# Altium schematic sheet 07_DC Jack and DCDC.SchDoc: C200
size 594 x 420 mm; Page Create Date: March  8, 1995; Page Number: 7; Page Size: A2; Comment: radxa_1010; Page Count: 21; RevCode: V1.11; Doc: 07_DC Jack and DCDC; DsnPath: D:\WMS\C200\CC122\对外\C200 V1.11.DSN; SchematicName: c200; PageName: 07_DC Jack and DCDC; PageSize: A2; TopSchematic: True
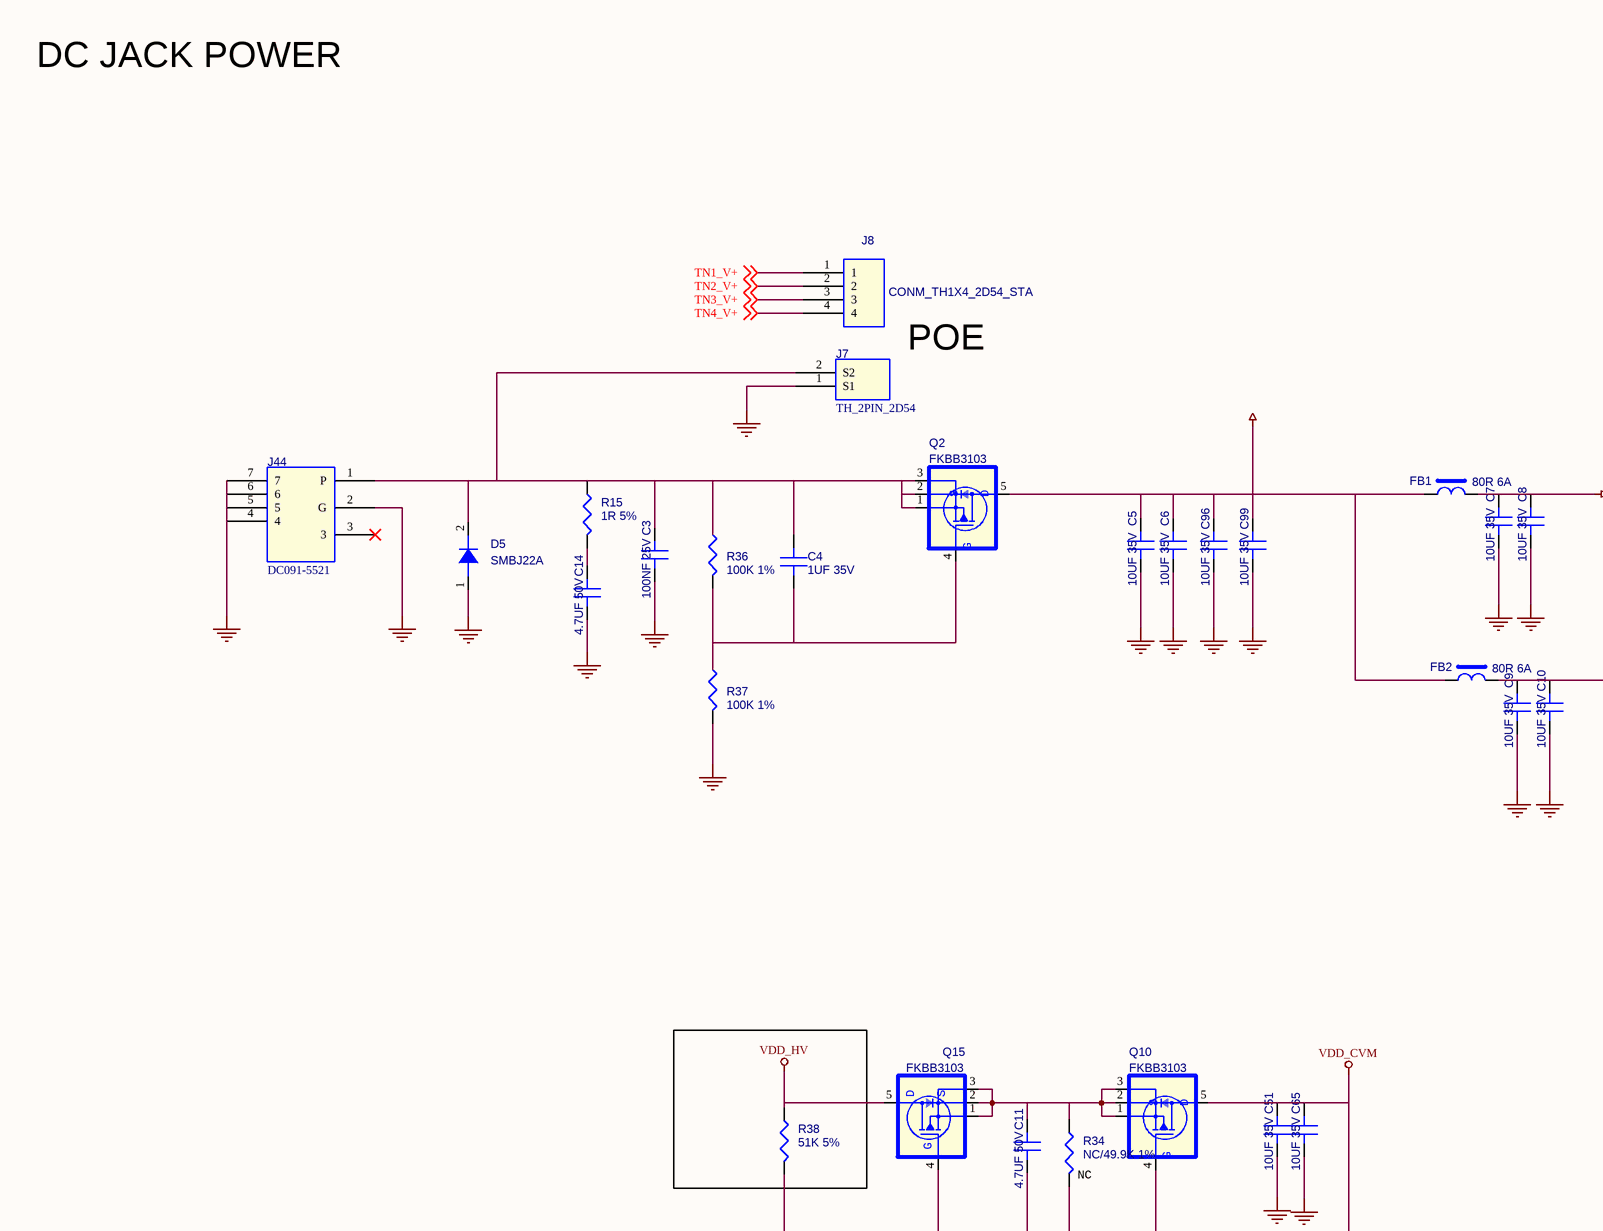
[diagram p0: 07_DC Jack and DCDC.SchDoc, top left]
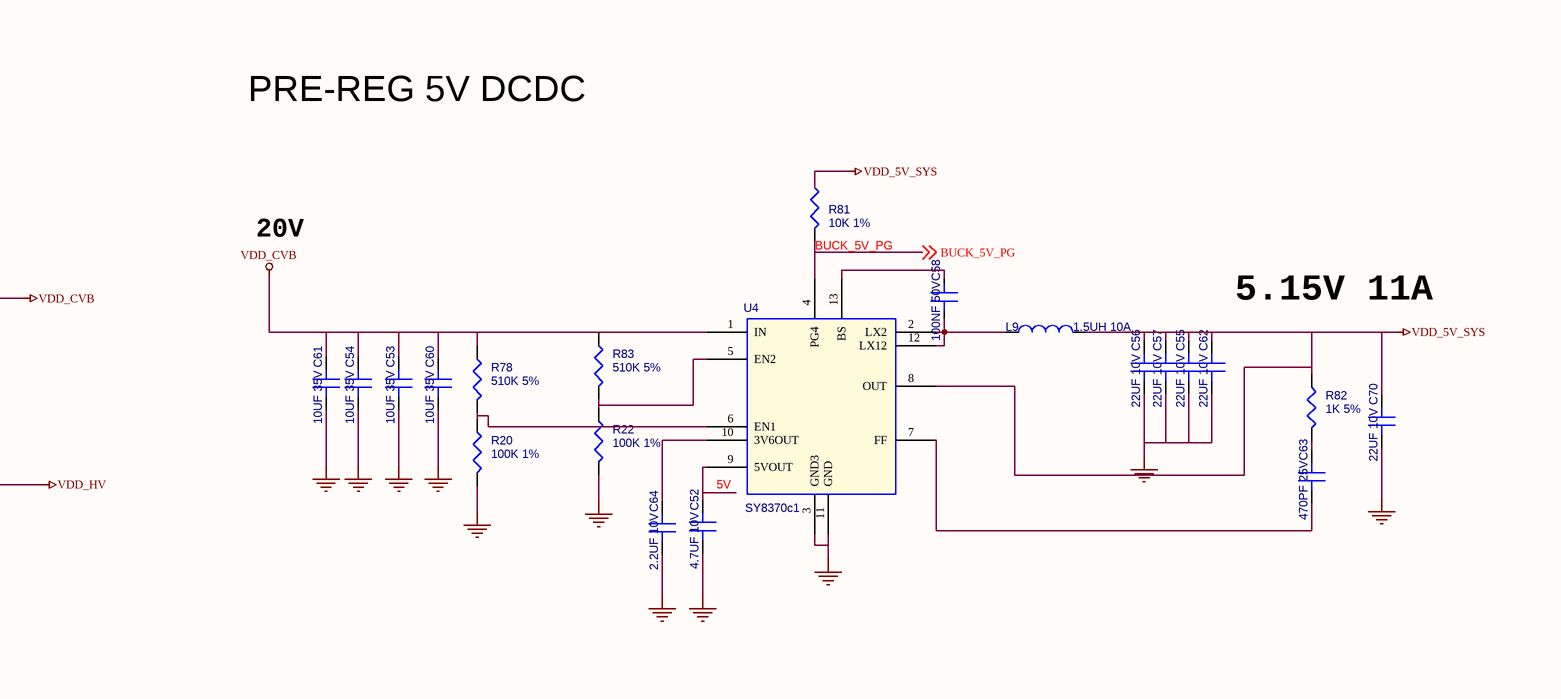
[diagram p1: 07_DC Jack and DCDC.SchDoc, top right]
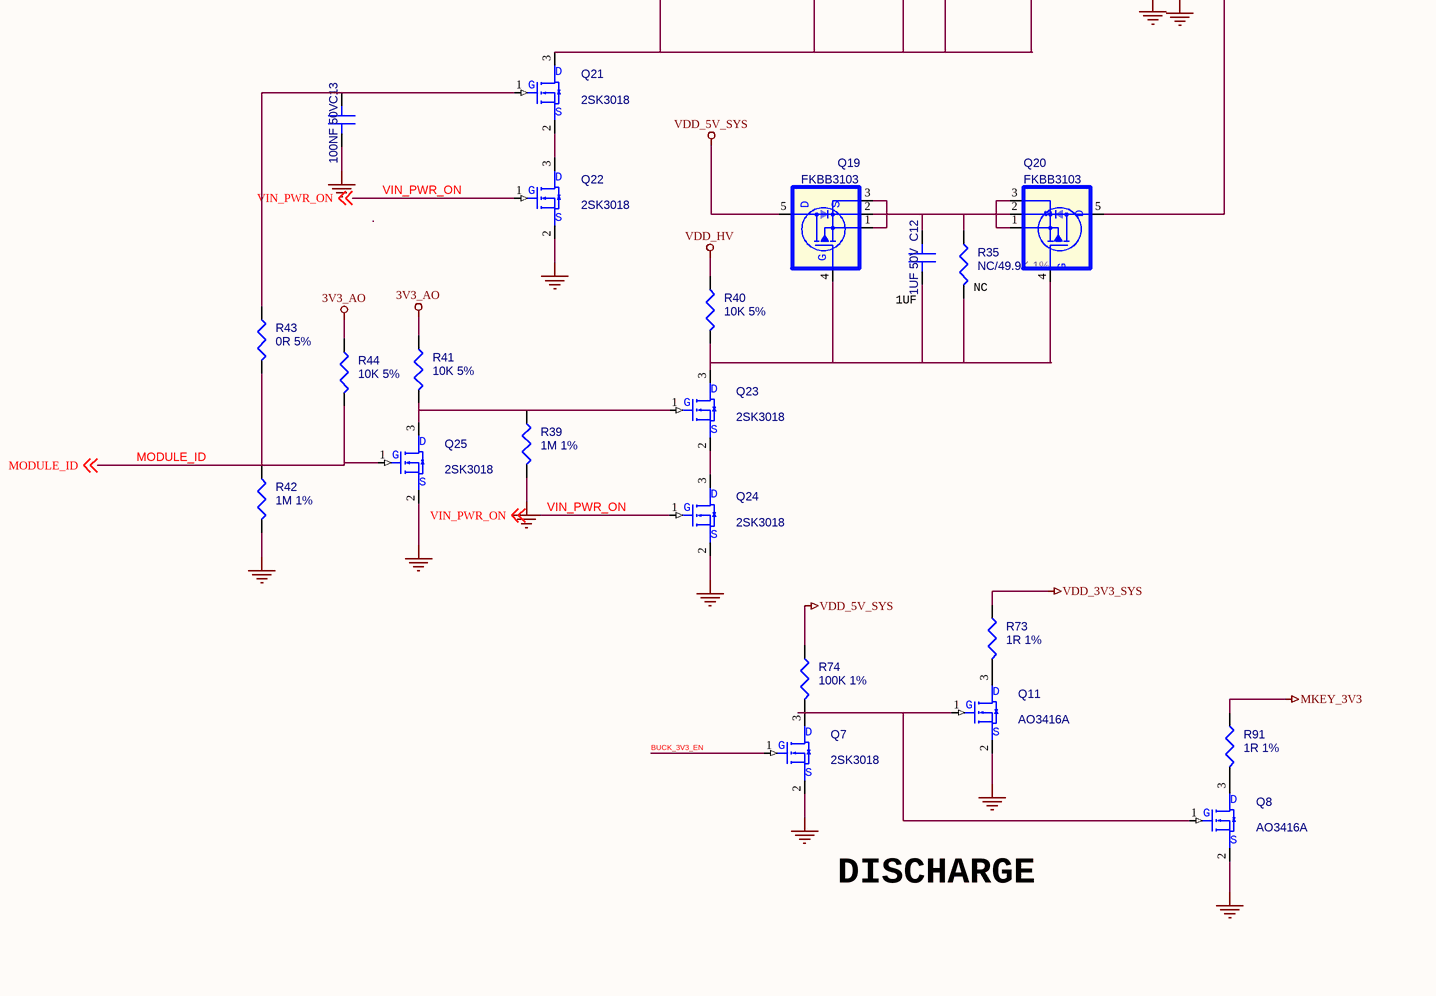
[diagram p2: 07_DC Jack and DCDC.SchDoc, bottom left]
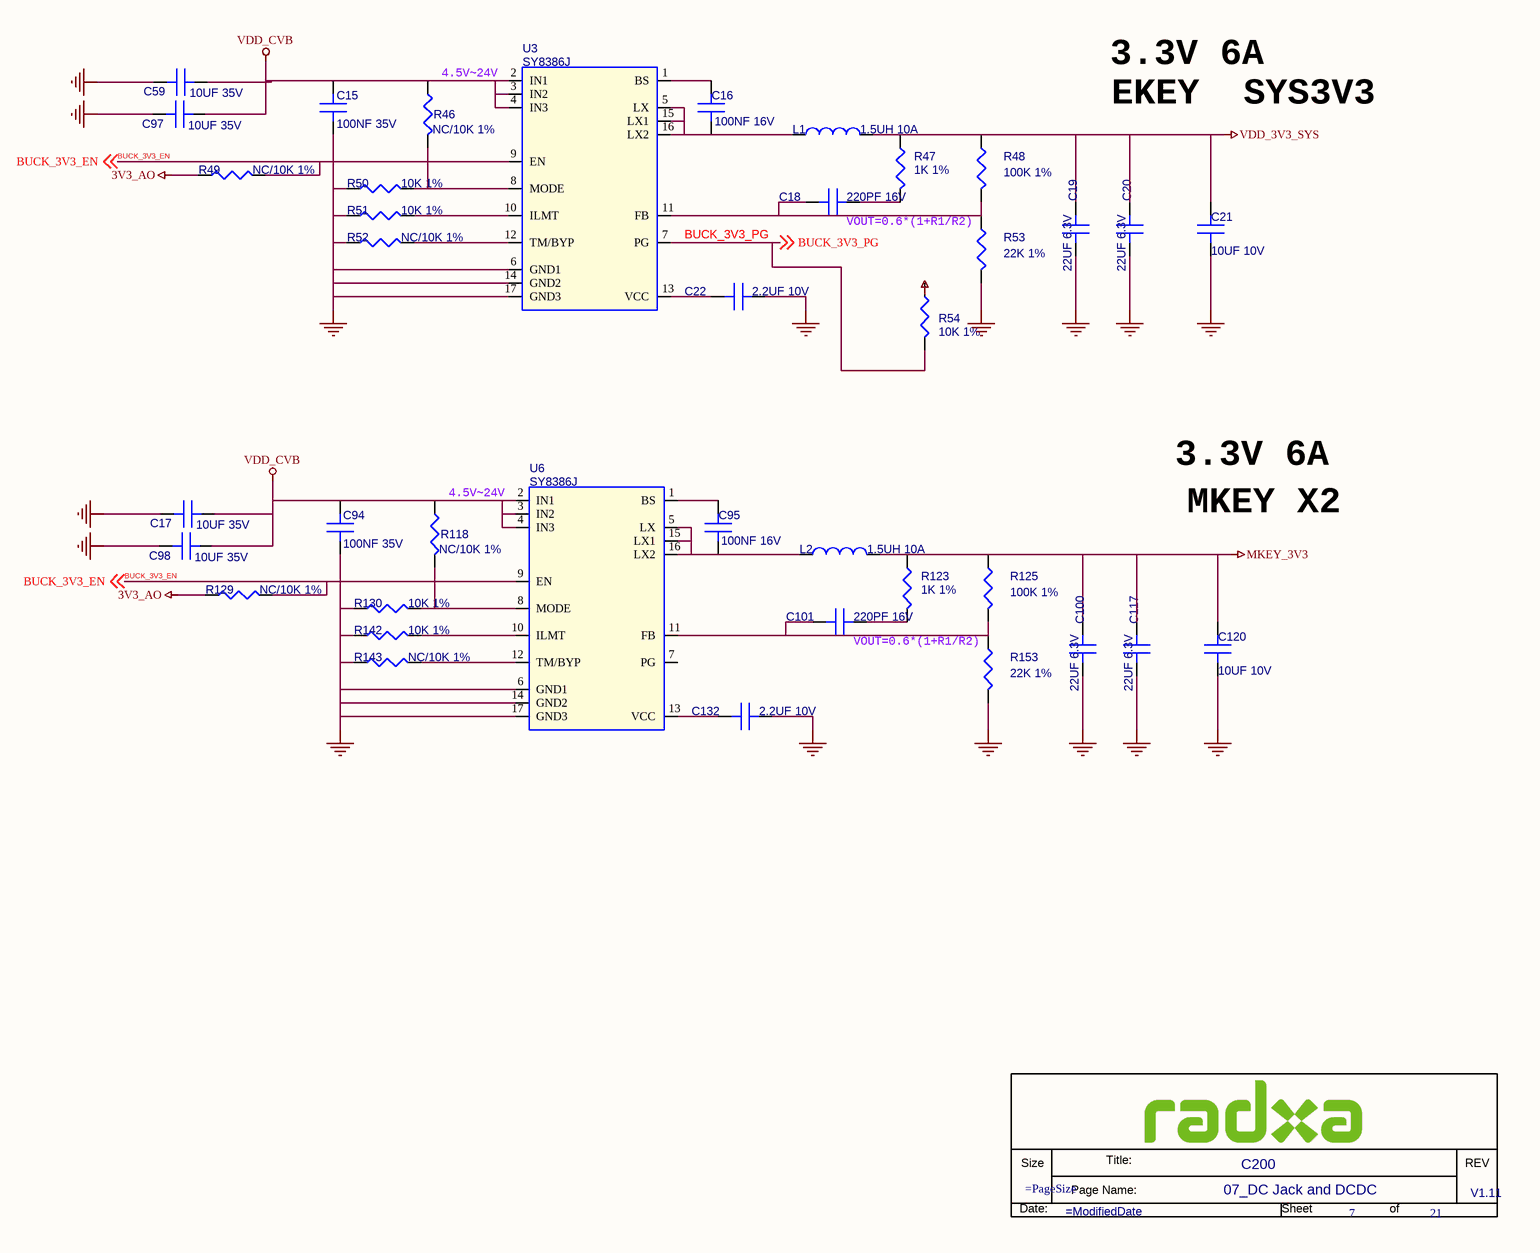
[diagram p3: 07_DC Jack and DCDC.SchDoc, bottom right]

## Parts
*  Doc: 07_DC Jack and DCDC  RevCode: V1.11  Title: C200  Page Number: 7  Page Count: 21  (hidden comment: radxa_1010)  (graphical)
C3  100NF 25V  [C0402]
C4  1UF 35V  [C0402]
C5  10UF 35V  [C1206]
C6  10UF 35V  [C1206]
C7  10UF 35V  [C1206]
C8  10UF 35V  [C1206]
C9  10UF 35V  [C1206]
C10  10UF 35V  [C1206]
C11  4.7UF 50V  [C0805]
C12  1UF 50V  [C0805]
C13  100NF 50V  [C0201]
C14  4.7UF 50V  [C0805]
C15  100NF 35V  [C0201]
C16  100NF 16V  [C0402]
C17  10UF 35V  [C1206]
C18  220PF 16V  [C0402]
C19  22UF 6.3V  [C0603]
C20  22UF 6.3V  [C0603]
C21  10UF 10V  [C0603]
C22  2.2UF 10V  [C0402]
C51  10UF 35V  [C1206]
C52  4.7UF 10V  [C0402]
C53  10UF 35V  [C1206]
C54  10UF 35V  [C1206]
C55  22UF 10V  [C0603]
C56  22UF 10V  [C0603]
C57  22UF 10V  [C0603]
C58  100NF 50V  [C0201]
C59  10UF 35V  [C1206]
C60  10UF 35V  [C1206]
C61  10UF 35V  [C1206]
C62  22UF 10V  [C0603]
C63  470PF 25V  [C0201]
C64  2.2UF 10V  [C0402]
C65  10UF 35V  [C1206]
C70  22UF 10V  [C0603]
C94  100NF 35V  [C0201]
C95  100NF 16V  [C0402]
C96  10UF 35V  [C1206]
C97  10UF 35V  [C1206]
C98  10UF 35V  [C1206]
C99  10UF 35V  [C1206]
C100  22UF 6.3V  [C0603]
C101  220PF 16V  [C0402]
C117  22UF 6.3V  [C0603]
C120  10UF 10V  [C0603]
C132  2.2UF 10V  [C0402]
D5  SMBJ22A  [DO_214AA]
FB1  80R 6A  [FB0805]
FB2  80R 6A  [FB0805]
J7  TH_2PIN_2D54  [CON_TH1X2_2D54_STA]
J8  CONM_TH1X4_2D54_STA  [CONM_TH1X4_2D54_STA]
J44  DC091-5521  [DC_TH7_13D5x11D45]
L1  1.5UH 10A  [L_5030]
L2  1.5UH 10A  [L_5030]
L9  1.5UH 10A  [L_5030]
Q2  FKBB3103  [DFN3X3_EP]
Q7  2SK3018  [SOT_323]
Q8  AO3416A  [SOT_23]
Q10  FKBB3103  [DFN3X3_EP]
Q11  AO3416A  [SOT_23]
Q15  FKBB3103  [DFN3X3_EP]
Q19  FKBB3103  [DFN3X3_EP]
Q20  FKBB3103  [DFN3X3_EP]
Q21  2SK3018  [SOT_323]
Q22  2SK3018  [SOT_323]
Q23  2SK3018  [SOT_323]
Q24  2SK3018  [SOT_323]
Q25  2SK3018  [SOT_323]
R15  1R 5%  [R0402]
R20  100K 1%  [R0402]
R22  100K 1%  [R0402]
R34  NC/49.9K 1%  [R0402]
R35  NC/49.9K 1%  [R0402]
R36  100K 1%  [R0402]
R37  100K 1%  [R0402]
R38  51K 5%  [R0402]
R39  1M 1%  [R0402]
R40  10K 5%  [R0402]
R41  10K 5%  [R0402]
R42  1M 1%  [R0402]
R43  0R 5%  [R0402]
R44  10K 5%  [R0402]
R46  NC/10K 1%  [R0402]
R47  1K 1%  [R0402]
R48  100K 1%  [R0402]
R49  NC/10K 1%  [R0402]
R50  10K 1%  [R0402]
R51  10K 1%  [R0402]
R52  NC/10K 1%  [R0402]
R53  22K 1%  [R0402]
R54  10K 1%  [R0402]
R73  1R 1%  [R0402]
R74  100K 1%  [R0402]
R78  510K 5%  [R0402]
R81  10K 1%  [R0402]
R82  1K 5%  [R0402]
R83  510K 5%  [R0402]
R91  1R 1%  [R0402]
R118  NC/10K 1%  [R0402]
R123  1K 1%  [R0402]
R125  100K 1%  [R0402]
R129  NC/10K 1%  [R0402]
R130  10K 1%  [R0402]
R142  10K 1%  [R0402]
R143  NC/10K 1%  [R0402]
R153  22K 1%  [R0402]
U3  SY8386J  [qfn-16-2525]
U4  SY8370c1  [SY8370]
U6  SY8386J  [qfn-16-2525]

## Nets
3V3_AO: R41.1 R44.1 R49.1 R129.1
GND: C3.2(B) C5.2(B) C6.2(B) C7.2(B) C8.2(B) C9.2(B) C10.2(B) C13.2(B) C14.2(B) C15.1(A) C17.2(B) C19.2(B) C20.2(B) C21.2(B) C22.2(B) C51.2(B) C52.2(B) C53.2(B) C54.2(B) C55.2(B) C56.2(B) C57.2(B) C59.2(B) C60.2(B) C61.2(B) C62.2(B) C64.2(B) C65.2(B) C70.2(B) C94.1(A) C96.2(B) C97.2(B) C98.2(B) C99.2(B) C100.2(B) C117.2(B) C120.2(B) C132.2(B) D5.1(A) J7.1(S1) J44.2(G) J44.4 J44.5 J44.6 J44.7 Q7.2(S) Q8.2(S) Q11.2(S) Q22.2(S) Q24.2(S) Q25.2(S) R20.2 R22.2 R37.2 R39.2 R42.2 R50.1 R51.1 R52.1 R53.2 R130.1 R142.1 R143.1 R153.2 U3.6(GND1) U3.14(GND2) U3.17(GND3) U4.3(GND3) U4.11(GND) U6.6(GND1) U6.14(GND2) U6.17(GND3)
MKEY_3V3: C100.1(A) C117.1(A) C120.1(A) L2.2 R91.1 R123.1 R125.1
VDD_3V3_SYS: C19.1(A) C20.1(A) C21.1(A) L1.2 R47.1 R48.1 R73.1
VDD_5V_SYS: C55.1(A) C56.1(A) C57.1(A) C62.1(A) C70.1(A) L9.2 Q19.5(D) R74.1 R81.1 R82.1 U4.8(OUT)
VDD_CVB: C7.1(A) C8.1(A) C15.2(B) C17.1(A) C53.1(A) C54.1(A) C59.1(A) C60.1(A) C61.1(A) C94.2(B) C97.1(A) C98.1(A) FB1.2 R46.1 R78.1 R83.1 R118.1 U3.2(IN1) U3.3(IN2) U3.4(IN3) U4.1(IN) U6.2(IN1) U6.3(IN2) U6.4(IN3)
VDD_CVM: C51.1(A) C65.1(A) Q10.5(D) Q20.5(D)
VDD_DCIN: C5.1(A) C6.1(A) C96.1(A) C99.1(A) FB1.1 FB2.1 Q2.5(D)
VDD_HV: C9.1(A) C10.1(A) FB2.2 Q15.5(D) R38.1 R40.1
5V: C52.1(A) U4.9(5VOUT)
BUCK_3V3_EN: Q7.1(G) R49.2 R129.2 U3.9(EN) U6.9(EN) ; off-sheet BUCK_3V3_EN
BUCK_3V3_PG: R54.2 U3.7(PG) ; off-sheet BUCK_3V3_PG
BUCK_5V_PG: R81.2 U4.4(PG4) ; off-sheet BUCK_5V_PG
MODULE_ID: Q25.1(G) R42.1 R43.2 R44.2 ; off-sheet MODULE_ID
TN1_V+: J8.1 ; off-sheet TN1_V+
TN2_V+: J8.2 ; off-sheet TN2_V+
TN3_V+: J8.3 ; off-sheet TN3_V+
TN4_V+: J8.4 ; off-sheet TN4_V+
VIN_PWR_ON: Q22.1(G) Q24.1(G) ; off-sheet VIN_PWR_ON
NetC3_1: C3.1(A) C4.1(A) D5.2(K) J7.2(S2) J44.1(P) Q2.1(S1) Q2.2(S2) Q2.3(S3) R15.1 R36.1
NetC4_2: C4.2(B) Q2.4(G) R36.2 R37.1
NetC11_1: C11.1(A) Q10.1(S1) Q10.2(S2) Q10.3(S3) Q15.1(S1) Q15.2(S2) Q15.3(S3) R34.1
NetC11_2: C11.2(B) Q10.4(G) Q15.4(G) Q21.3(D) R34.2 R38.2
NetC12_1: C12.1(A) Q19.1(S1) Q19.2(S2) Q19.3(S3) Q20.1(S1) Q20.2(S2) Q20.3(S3) R35.1
NetC12_2: C12.2(B) Q19.4(G) Q20.4(G) Q23.3(D) R35.2 R40.2
NetC13_1: C13.1(A) Q21.1(G) R43.1
NetC14_1: C14.1(A) R15.2
NetC16_1: C16.1(A) L1.1 U3.5(LX) U3.15(LX1) U3.16(LX2)
NetC16_2: C16.2(B) U3.1(BS)
NetC18_1: C18.1(A) R48.2 R53.1 U3.11(FB)
NetC18_2: C18.2(B) R47.2
NetC22_1: C22.1(A) U3.13(VCC)
NetC58_1: C58.1(A) U4.13(BS)
NetC58_2: C58.2(B) L9.1 U4.2(LX2) U4.12(LX12)
NetC63_1: C63.1(A) R82.2
NetC63_2: C63.2(B) U4.7(FF)
NetC64_1: C64.1(A) U4.10(3V6OUT)
NetC95_1: C95.1(A) L2.1 U6.5(LX) U6.15(LX1) U6.16(LX2)
NetC95_2: C95.2(B) U6.1(BS)
NetC101_1: C101.1(A) R125.2 R153.1 U6.11(FB)
NetC101_2: C101.2(B) R123.2
NetC132_1: C132.1(A) U6.13(VCC)
NetQ7_3: Q7.3(D) Q8.1(G) Q11.1(G) R74.2
NetQ8_3: Q8.3(D) R91.2
NetQ11_3: Q11.3(D) R73.2
NetQ21_2: Q21.2(S) Q22.3(D)
NetQ23_1: Q23.1(G) Q25.3(D) R39.1 R41.2
NetQ23_2: Q23.2(S) Q24.3(D)
NetR20_1: R20.1 R78.2 U4.6(EN1)
NetR22_1: R22.1 R83.2 U4.5(EN2)
NetR46_2: R46.2 R50.2 U3.8(MODE)
NetR51_2: R51.2 U3.10(ILMT)
NetR52_2: R52.2 U3.12(TM/BYP)
NetR118_2: R118.2 R130.2 U6.8(MODE)
NetR142_2: R142.2 U6.10(ILMT)
NetR143_2: R143.2 U6.12(TM/BYP)

Not connected (* = marked no-connect by the designer): J44 3*; R54 1; U6 7(PG)

## Notes on the sheet
- DC JACK POWER
- PRE-REG 5V DCDC
- POE
- 20V
- 5.15V 11A
- 4.5V~24V
- 3.3V 6A
- EKEY  SYS3V3
- (near R34) NC
- (near C18) VOUT=0.6*(1+R1/R2)
- (near C12) 1UF
- (near R35) NC
- MKEY X2
- (near C101) VOUT=0.6*(1+R1/R2)
- DISCHARGE
- (in symbol MOSEFT_PNP_5P) S
- (in symbol radxa_1010) Title:; Size; REV; Page Name:; Date:; Sheet; of

## Library data of the parts
C3 = C: SMD  0402  100NF  25V  X5R  ±20%  ROHS; PARTS: 1; Part Reference: C3; Part Number: A1C01.00061; OriginalSymbolOrigin: (0,30); PKG_TYPE: CAP2-100-250; LEVEL: STD; PINSWAP: (A,B); Value: 100NF 25V; Part Type: 陶瓷电容; PCB Footprint: C0402
C4 = C: SMD  0402  1UF  35V  X5R  ±10%  ROHS; PARTS: 1; Part Reference: C4; Part Number: A1C01.00332; OriginalSymbolOrigin: (0,30); PKG_TYPE: CAP2-100-250; LEVEL: STD; PINSWAP: (A,B); Value: 1UF 35V; Part Type: 陶瓷电容; PCB Footprint: C0402
C5 = C: SMD  1206  10UF  35V  X5R  ±10%  ROHS; PARTS: 1; Part Reference: C5; Part Number: A1C01.00333; OriginalSymbolOrigin: (0,30); PKG_TYPE: CAP2-100-250; LEVEL: STD; PINSWAP: (A,B); Value: 10UF 35V; Part Type: 陶瓷电容; PCB Footprint: C1206
C6 = C: SMD  1206  10UF  35V  X5R  ±10%  ROHS; PARTS: 1; Part Reference: C6; Part Number: A1C01.00333; OriginalSymbolOrigin: (0,30); PKG_TYPE: CAP2-100-250; LEVEL: STD; PINSWAP: (A,B); Value: 10UF 35V; Part Type: 陶瓷电容; PCB Footprint: C1206
C7 = C: SMD  1206  10UF  35V  X5R  ±10%  ROHS; PARTS: 1; Part Reference: C7; Part Number: A1C01.00333; OriginalSymbolOrigin: (0,30); PKG_TYPE: CAP2-100-250; LEVEL: STD; PINSWAP: (A,B); Value: 10UF 35V; Part Type: 陶瓷电容; PCB Footprint: C1206
C8 = C: SMD  1206  10UF  35V  X5R  ±10%  ROHS; PARTS: 1; Part Reference: C8; Part Number: A1C01.00333; OriginalSymbolOrigin: (0,30); PKG_TYPE: CAP2-100-250; LEVEL: STD; PINSWAP: (A,B); Value: 10UF 35V; Part Type: 陶瓷电容; PCB Footprint: C1206
C9 = C: SMD  1206  10UF  35V  X5R  ±10%  ROHS; PARTS: 1; Part Reference: C9; Part Number: A1C01.00333; OriginalSymbolOrigin: (0,30); PKG_TYPE: CAP2-100-250; LEVEL: STD; PINSWAP: (A,B); Value: 10UF 35V; Part Type: 陶瓷电容; PCB Footprint: C1206
C10 = C: SMD  1206  10UF  35V  X5R  ±10%  ROHS; PARTS: 1; Part Reference: C10; Part Number: A1C01.00333; OriginalSymbolOrigin: (0,30); PKG_TYPE: CAP2-100-250; LEVEL: STD; PINSWAP: (A,B); Value: 10UF 35V; Part Type: 陶瓷电容; PCB Footprint: C1206
C11 = C: SMD  0805  4.7UF  50V  X5R  ±10%  ROHS; PARTS: 1; Part Reference: C11; Part Number: A1C01.00253; OriginalSymbolOrigin: (0,30); PKG_TYPE: CAP2-100-250; LEVEL: STD; PINSWAP: (A,B); Value: 4.7UF 50V; Part Type: 陶瓷电容; PCB Footprint: C0805
C12 = C: SMD  0805  1UF  50V  X5R  ±10%  ROHS; PARTS: 1; Part Reference: C12; Part Number: A1C01.00243; OriginalSymbolOrigin: (0,30); PKG_TYPE: CAP2-100-250; LEVEL: STD; PINSWAP: (A,B); Preferred: 6715f349cd0bc5; Value: 1UF 50V; Part Type: 陶瓷电容; PCB Footprint: C0805
C13 = C: SMD  0201  100NF  50V  NPO  ±10%  ROHS; PARTS: 1; Part Reference: C13; Part Number: A1C01.00279; OriginalSymbolOrigin: (0,30); PKG_TYPE: CAP2-100-250; LEVEL: STD; PINSWAP: (A,B); Value: 100NF 50V; Part Type: 陶瓷电容; PCB Footprint: C0201
C14 = C: SMD  0805  4.7UF  50V  X5R  ±10%  ROHS; PARTS: 1; Part Reference: C14; Part Number: A1C01.00253; OriginalSymbolOrigin: (0,30); PKG_TYPE: CAP2-100-250; LEVEL: STD; PINSWAP: (A,B); Value: 4.7UF 50V; Part Type: 陶瓷电容; PCB Footprint: C0805
C15 = C: SMD  0201  100NF  35V  X5R  ±20%  ROHS; PARTS: 1; Part Reference: C15; Part Number: A1C01.00103; OriginalSymbolOrigin: (0,30); PKG_TYPE: CAP2-100-250; LEVEL: STD; PINSWAP: (A,B); Value: 100NF 35V; Part Type: 陶瓷电容; PCB Footprint: C0201
C16 = C: SMD  0402  100NF  16V  X5R  ±10%  ROHS; PARTS: 1; Part Reference: C16; Part Number: A1C01.00045; OriginalSymbolOrigin: (0,30); PKG_TYPE: CAP2-100-250; LEVEL: STD; PINSWAP: (A,B); Value: 100NF 16V; Part Type: 陶瓷电容; PCB Footprint: C0402
C17 = C: SMD  1206  10UF  35V  X5R  ±10%  ROHS; PARTS: 1; Part Reference: C17; Part Number: A1C01.00333; OriginalSymbolOrigin: (0,30); PKG_TYPE: CAP2-100-250; LEVEL: STD; PINSWAP: (A,B); Value: 10UF 35V; Part Type: 陶瓷电容; PCB Footprint: C1206
C18 = C: SMD  0402  220PF  16V  X7R  ±10%  ROHS; PARTS: 1; Part Reference: C18; Part Number: A1C01.00040; OriginalSymbolOrigin: (0,30); PKG_TYPE: CAP2-100-250; LEVEL: STD; PINSWAP: (A,B); Value: 220PF 16V; Part Type: 陶瓷电容; PCB Footprint: C0402
C19 = C: SMD  0603  22UF  6.3V  X5R  ±20%  ROHS; PARTS: 1; Part Reference: C19; Part Number: A1C01.00004; OriginalSymbolOrigin: (0,30); PKG_TYPE: CAP2-100-250; LEVEL: STD; PINSWAP: (A,B); Value: 22UF 6.3V; Part Type: 陶瓷电容; PCB Footprint: C0603
C20 = C: SMD  0603  22UF  6.3V  X5R  ±20%  ROHS; PARTS: 1; Part Reference: C20; Part Number: A1C01.00004; OriginalSymbolOrigin: (0,30); PKG_TYPE: CAP2-100-250; LEVEL: STD; PINSWAP: (A,B); Value: 22UF 6.3V; Part Type: 陶瓷电容; PCB Footprint: C0603
C21 = C: SMD  0603  10UF  10V  X5R  ±10%  ROHS; PARTS: 1; Part Reference: C21; Part Number: A1C01.00270; OriginalSymbolOrigin: (0,30); PKG_TYPE: CAP2-100-250; LEVEL: STD; PINSWAP: (A,B); Value: 10UF 10V; Part Type: 陶瓷电容; PCB Footprint: C0603
C22 = C: SMD  0402  2.2UF  10V  X5R  ±10%  ROHS; PARTS: 1; Part Reference: C22; Part Number: A1C01.00194; OriginalSymbolOrigin: (0,30); PKG_TYPE: CAP2-100-250; LEVEL: STD; PINSWAP: (A,B); Value: 2.2UF 10V; Part Type: 陶瓷电容; PCB Footprint: C0402
C51 = C: SMD  1206  10UF  35V  X5R  ±10%  ROHS; PARTS: 1; Part Reference: C51; Part Number: A1C01.00333; OriginalSymbolOrigin: (0,30); PKG_TYPE: CAP2-100-250; LEVEL: STD; PINSWAP: (A,B); Value: 10UF 35V; Part Type: 陶瓷电容; PCB Footprint: C1206
C52 = C: SMD  0402  4.7UF  10V  X5R  ±10%  ROHS; PARTS: 1; Part Reference: C52; Part Number: A1C01.00295; OriginalSymbolOrigin: (0,30); PKG_TYPE: CAP2-100-250; LEVEL: STD; PINSWAP: (A,B); Value: 4.7UF 10V; Part Type: 陶瓷电容; PCB Footprint: C0402
C53 = C: SMD  1206  10UF  35V  X5R  ±10%  ROHS; PARTS: 1; Part Reference: C53; Part Number: A1C01.00333; OriginalSymbolOrigin: (0,30); PKG_TYPE: CAP2-100-250; LEVEL: STD; PINSWAP: (A,B); Value: 10UF 35V; Part Type: 陶瓷电容; PCB Footprint: C1206
C54 = C: SMD  1206  10UF  35V  X5R  ±10%  ROHS; PARTS: 1; Part Reference: C54; Part Number: A1C01.00333; OriginalSymbolOrigin: (0,30); PKG_TYPE: CAP2-100-250; LEVEL: STD; PINSWAP: (A,B); Value: 10UF 35V; Part Type: 陶瓷电容; PCB Footprint: C1206
C55 = C: SMD  0603  22UF  10V  X5R  ±20%  ROHS; PARTS: 1; Part Reference: C55; Part Number: A1C01.00015; OriginalSymbolOrigin: (0,30); PKG_TYPE: CAP2-100-250; LEVEL: STD; PINSWAP: (A,B); Value: 22UF 10V; Part Type: 陶瓷电容; PCB Footprint: C0603
C56 = C: SMD  0603  22UF  10V  X5R  ±20%  ROHS; PARTS: 1; Part Reference: C56; Part Number: A1C01.00015; OriginalSymbolOrigin: (0,30); PKG_TYPE: CAP2-100-250; LEVEL: STD; PINSWAP: (A,B); Value: 22UF 10V; Part Type: 陶瓷电容; PCB Footprint: C0603
C57 = C: SMD  0603  22UF  10V  X5R  ±20%  ROHS; PARTS: 1; Part Reference: C57; Part Number: A1C01.00015; OriginalSymbolOrigin: (0,30); PKG_TYPE: CAP2-100-250; LEVEL: STD; PINSWAP: (A,B); Value: 22UF 10V; Part Type: 陶瓷电容; PCB Footprint: C0603
C58 = C: SMD  0201  100NF  50V  NPO  ±10%  ROHS; PARTS: 1; Part Reference: C58; Part Number: A1C01.00279; OriginalSymbolOrigin: (0,30); PKG_TYPE: CAP2-100-250; LEVEL: STD; PINSWAP: (A,B); Value: 100NF 50V; Part Type: 陶瓷电容; PCB Footprint: C0201
C59 = C: SMD  1206  10UF  35V  X5R  ±10%  ROHS; PARTS: 1; Part Reference: C59; Part Number: A1C01.00333; OriginalSymbolOrigin: (0,30); PKG_TYPE: CAP2-100-250; LEVEL: STD; PINSWAP: (A,B); Value: 10UF 35V; Part Type: 陶瓷电容; PCB Footprint: C1206
C60 = C: SMD  1206  10UF  35V  X5R  ±10%  ROHS; PARTS: 1; Part Reference: C60; Part Number: A1C01.00333; OriginalSymbolOrigin: (0,30); PKG_TYPE: CAP2-100-250; LEVEL: STD; PINSWAP: (A,B); Value: 10UF 35V; Part Type: 陶瓷电容; PCB Footprint: C1206
C61 = C: SMD  1206  10UF  35V  X5R  ±10%  ROHS; PARTS: 1; Part Reference: C61; Part Number: A1C01.00333; OriginalSymbolOrigin: (0,30); PKG_TYPE: CAP2-100-250; LEVEL: STD; PINSWAP: (A,B); Value: 10UF 35V; Part Type: 陶瓷电容; PCB Footprint: C1206
C62 = C: SMD  0603  22UF  10V  X5R  ±20%  ROHS; PARTS: 1; Part Reference: C62; Part Number: A1C01.00015; OriginalSymbolOrigin: (0,30); PKG_TYPE: CAP2-100-250; LEVEL: STD; PINSWAP: (A,B); Value: 22UF 10V; Part Type: 陶瓷电容; PCB Footprint: C0603
C63 = C: SMD  0201  470PF  25V  X7R  ±10%  ROHS; PARTS: 1; Part Reference: C63; Part Number: A1C01.00137; OriginalSymbolOrigin: (0,30); PKG_TYPE: CAP2-100-250; LEVEL: STD; PINSWAP: (A,B); Value: 470PF 25V; Part Type: 陶瓷电容; PCB Footprint: C0201
C64 = C: SMD  0402  2.2UF  10V  X5R  ±10%  ROHS; PARTS: 1; Part Reference: C64; Part Number: A1C01.00194; OriginalSymbolOrigin: (0,30); PKG_TYPE: CAP2-100-250; LEVEL: STD; PINSWAP: (A,B); Value: 2.2UF 10V; Part Type: 陶瓷电容; PCB Footprint: C0402
C65 = C: SMD  1206  10UF  35V  X5R  ±10%  ROHS; PARTS: 1; Part Reference: C65; Part Number: A1C01.00333; OriginalSymbolOrigin: (0,30); PKG_TYPE: CAP2-100-250; LEVEL: STD; PINSWAP: (A,B); Value: 10UF 35V; Part Type: 陶瓷电容; PCB Footprint: C1206
C70 = C: SMD  0603  22UF  10V  X5R  ±20%  ROHS; PARTS: 1; Part Reference: C70; Part Number: A1C01.00015; OriginalSymbolOrigin: (0,30); PKG_TYPE: CAP2-100-250; LEVEL: STD; PINSWAP: (A,B); Value: 22UF 10V; Part Type: 陶瓷电容; PCB Footprint: C0603
C94 = C: SMD  0201  100NF  35V  X5R  ±20%  ROHS; PARTS: 1; Part Reference: C94; Part Number: A1C01.00103; OriginalSymbolOrigin: (0,30); PKG_TYPE: CAP2-100-250; LEVEL: STD; PINSWAP: (A,B); Value: 100NF 35V; Part Type: 陶瓷电容; PCB Footprint: C0201
C95 = C: SMD  0402  100NF  16V  X5R  ±10%  ROHS; PARTS: 1; Part Reference: C95; Part Number: A1C01.00045; OriginalSymbolOrigin: (0,30); PKG_TYPE: CAP2-100-250; LEVEL: STD; PINSWAP: (A,B); Value: 100NF 16V; Part Type: 陶瓷电容; PCB Footprint: C0402
C96 = C: SMD  1206  10UF  35V  X5R  ±10%  ROHS; PARTS: 1; Part Reference: C96; Part Number: A1C01.00333; OriginalSymbolOrigin: (0,30); PKG_TYPE: CAP2-100-250; LEVEL: STD; PINSWAP: (A,B); Value: 10UF 35V; Part Type: 陶瓷电容; PCB Footprint: C1206
C97 = C: SMD  1206  10UF  35V  X5R  ±10%  ROHS; PARTS: 1; Part Reference: C97; Part Number: A1C01.00333; OriginalSymbolOrigin: (0,30); PKG_TYPE: CAP2-100-250; LEVEL: STD; PINSWAP: (A,B); Value: 10UF 35V; Part Type: 陶瓷电容; PCB Footprint: C1206
C98 = C: SMD  1206  10UF  35V  X5R  ±10%  ROHS; PARTS: 1; Part Reference: C98; Part Number: A1C01.00333; OriginalSymbolOrigin: (0,30); PKG_TYPE: CAP2-100-250; LEVEL: STD; PINSWAP: (A,B); Value: 10UF 35V; Part Type: 陶瓷电容; PCB Footprint: C1206
C99 = C: SMD  1206  10UF  35V  X5R  ±10%  ROHS; PARTS: 1; Part Reference: C99; Part Number: A1C01.00333; OriginalSymbolOrigin: (0,30); PKG_TYPE: CAP2-100-250; LEVEL: STD; PINSWAP: (A,B); Value: 10UF 35V; Part Type: 陶瓷电容; PCB Footprint: C1206
C100 = C: SMD  0603  22UF  6.3V  X5R  ±20%  ROHS; PARTS: 1; Part Reference: C100; Part Number: A1C01.00004; OriginalSymbolOrigin: (0,30); PKG_TYPE: CAP2-100-250; LEVEL: STD; PINSWAP: (A,B); Value: 22UF 6.3V; Part Type: 陶瓷电容; PCB Footprint: C0603
C101 = C: SMD  0402  220PF  16V  X7R  ±10%  ROHS; PARTS: 1; Part Reference: C101; Part Number: A1C01.00040; OriginalSymbolOrigin: (0,30); PKG_TYPE: CAP2-100-250; LEVEL: STD; PINSWAP: (A,B); Value: 220PF 16V; Part Type: 陶瓷电容; PCB Footprint: C0402
C117 = C: SMD  0603  22UF  6.3V  X5R  ±20%  ROHS; PARTS: 1; Part Reference: C117; Part Number: A1C01.00004; OriginalSymbolOrigin: (0,30); PKG_TYPE: CAP2-100-250; LEVEL: STD; PINSWAP: (A,B); Value: 22UF 6.3V; Part Type: 陶瓷电容; PCB Footprint: C0603
C120 = C: SMD  0603  10UF  10V  X5R  ±10%  ROHS; PARTS: 1; Part Reference: C120; Part Number: A1C01.00270; OriginalSymbolOrigin: (0,30); PKG_TYPE: CAP2-100-250; LEVEL: STD; PINSWAP: (A,B); Value: 10UF 10V; Part Type: 陶瓷电容; PCB Footprint: C0603
C132 = C: SMD  0402  2.2UF  10V  X5R  ±10%  ROHS; PARTS: 1; Part Reference: C132; Part Number: A1C01.00194; OriginalSymbolOrigin: (0,30); PKG_TYPE: CAP2-100-250; LEVEL: STD; PINSWAP: (A,B); Value: 2.2UF 10V; Part Type: 陶瓷电容; PCB Footprint: C0402
D5 = DIODE: SMD  DO-214AA  SMBJ22A  长晶  ROHS; Part Reference: D5; Part Number: A1D02.00122; PCB Footprint: DO_214AA; Value: SMBJ22A; Part Type: 二极管-ESD管-桥堆-TVS管
FB1 = BEAD: SMD  0805  FB80R  6A  ±25%  ROHS; Part Reference: FB1; Part Number: A1L09.00066; PCB Footprint: FB0805; Value: 80R 6A; Part Type: 贴片磁珠
FB2 = BEAD: SMD  0805  FB80R  6A  ±25%  ROHS; Part Reference: FB2; Part Number: A1L09.00066; PCB Footprint: FB0805; Value: 80R 6A; Part Type: 贴片磁珠
J7 = TH_2PIN_2D54: DIP  排针座  1*2PIN  180度  2.54mm脚距  中间朔高2.5mm  针长一端6.1mm  另一端3mm  黑色  PH2.54 1*2P L=11.6/3.0  国意英  ROHS; Part Reference: J7; Part Number: A1J02.00011; PCB Footprint: CONM_TH1X2_2D54_STA; Value: TH_2PIN_2D54; Part Type: 排座
J8 = CONM_TH1X4_2D54_STA: Part Reference: J8; Value: CONM_TH1X4_2D54_STA; PCB Footprint: CONM_TH1X4_2D54_STA
J44 = DC091_5521: DIP  6PIN  DC-091-A250  内孔Φ6mm  铁芯Φ2.5mm  13.2*10*H10.2mm  讯普  ROHS; Part Reference: J44; Part Number: A1J11.00012; Value: DC091-5521; Part Type: DC座; PCB Footprint: DC_TH7_13D5x11D45
L1 = L: SMD  带屏蔽  5*5*3mm  1.5UH  10A  ±20%  RXWSHC0530T-1R5  ROHS; Part Reference: L1; Part Number: A1L01.00003; PCB Footprint: L_5030; Value: 1.5UH 10A; Part Type: 贴片功率电感
L2 = L: SMD  带屏蔽  5*5*3mm  1.5UH  10A  ±20%  RXWSHC0530T-1R5  ROHS; Part Reference: L2; Part Number: A1L01.00003; PCB Footprint: L_5030; Value: 1.5UH 10A; Part Type: 贴片功率电感
L9 = L: SMD  带屏蔽  5*5*3mm  1.5UH  10A  ±20%  RXWSHC0530T-1R5  ROHS; Part Reference: L9; Part Number: A1L01.00003; PCB Footprint: L_5030; Value: 1.5UH 10A; Part Type: 贴片功率电感
Q2 = MOSEFT_PNP_5P: SMD  编带  DFN3X3  FKBB3103  P沟道  东沅  ROHS; Part Reference: Q2; Part Number: A1D01.00059; Temp Coeff: -55℃ to ＋150℃; Value: FKBB3103; Part Type: 三极管-MOS管; PCB Footprint: DFN3X3_EP
Q7 = MOSFET_NPN: SMD  编带  SOT-323  2SK3018  N沟道  长晶  ROHS; Part Reference: Q7; Part Number: A1D01.00007; Temp Coeff: -55℃ to ＋150℃; Value: 2SK3018; Part Type: 三极管-MOS管; PCB Footprint: SOT_323
Q8 = MOSFET_NPN: SMD  编带  SOT-23  AO3416A  N沟道  UMW(友台半导体)  ROHS; Part Reference: Q8; Part Number: A1D01.00078; Temp Coeff: -55℃ to +150℃; Value: AO3416A; Part Type: 三极管-MOS管; PCB Footprint: SOT_23
Q10 = MOSEFT_PNP_5P: SMD  编带  DFN3X3  FKBB3103  P沟道  东沅  ROHS; Part Reference: Q10; Part Number: A1D01.00059; Temp Coeff: -55℃ to ＋150℃; Value: FKBB3103; Part Type: 三极管-MOS管; PCB Footprint: DFN3X3_EP
Q11 = MOSFET_NPN: SMD  编带  SOT-23  AO3416A  N沟道  UMW(友台半导体)  ROHS; Part Reference: Q11; Part Number: A1D01.00078; Temp Coeff: -55℃ to +150℃; Value: AO3416A; Part Type: 三极管-MOS管; PCB Footprint: SOT_23
Q15 = MOSEFT_PNP_5P: SMD  编带  DFN3X3  FKBB3103  P沟道  东沅  ROHS; Part Reference: Q15; Part Number: A1D01.00059; Temp Coeff: -55℃ to ＋150℃; Value: FKBB3103; Part Type: 三极管-MOS管; PCB Footprint: DFN3X3_EP
Q19 = MOSEFT_PNP_5P: SMD  编带  DFN3X3  FKBB3103  P沟道  东沅  ROHS; Part Reference: Q19; Part Number: A1D01.00059; Temp Coeff: -55℃ to ＋150℃; Value: FKBB3103; Part Type: 三极管-MOS管; PCB Footprint: DFN3X3_EP
Q20 = MOSEFT_PNP_5P: SMD  编带  DFN3X3  FKBB3103  P沟道  东沅  ROHS; Part Reference: Q20; Part Number: A1D01.00059; Temp Coeff: -55℃ to ＋150℃; Value: FKBB3103; Part Type: 三极管-MOS管; PCB Footprint: DFN3X3_EP
Q21 = MOSFET_NPN: SMD  编带  SOT-323  2SK3018  N沟道  长晶  ROHS; Part Reference: Q21; Part Number: A1D01.00007; Temp Coeff: -55℃ to ＋150℃; Value: 2SK3018; Part Type: 三极管-MOS管; PCB Footprint: SOT_323
Q22 = MOSFET_NPN: SMD  编带  SOT-323  2SK3018  N沟道  长晶  ROHS; Part Reference: Q22; Part Number: A1D01.00007; Temp Coeff: -55℃ to ＋150℃; Value: 2SK3018; Part Type: 三极管-MOS管; PCB Footprint: SOT_323
Q23 = MOSFET_NPN: SMD  编带  SOT-323  2SK3018  N沟道  长晶  ROHS; Part Reference: Q23; Part Number: A1D01.00007; Temp Coeff: -55℃ to ＋150℃; Value: 2SK3018; Part Type: 三极管-MOS管; PCB Footprint: SOT_323
Q24 = MOSFET_NPN: SMD  编带  SOT-323  2SK3018  N沟道  长晶  ROHS; Part Reference: Q24; Part Number: A1D01.00007; Temp Coeff: -55℃ to ＋150℃; Value: 2SK3018; Part Type: 三极管-MOS管; PCB Footprint: SOT_323
Q25 = MOSFET_NPN: SMD  编带  SOT-323  2SK3018  N沟道  长晶  ROHS; Part Reference: Q25; Part Number: A1D01.00007; Temp Coeff: -55℃ to ＋150℃; Value: 2SK3018; Part Type: 三极管-MOS管; PCB Footprint: SOT_323
R15 = R: SMD  0402  1R  1/16W  ±5%  ROHS; Part Reference: R15; Part Number: A1R01.00220; PCB Footprint: R0402; Value: 1R 5%; Part Type: 贴片电阻
R20 = R: SMD  0201  100K  1/20W  ±1%  ROHS; Part Reference: R20; Part Number: A1R01.00165; PCB Footprint: R0201; Value: 100K 1%; Part Type: 贴片电阻
R22 = R: SMD  0201  100K  1/20W  ±1%  ROHS; Part Reference: R22; Part Number: A1R01.00165; PCB Footprint: R0201; Value: 100K 1%; Part Type: 贴片电阻
R34 = R: SMD  0402  49.9K  1/16W  ±1%  ROHS; Part Reference: R34; Part Number: A1R01.00309; PCB Footprint: R0402; Value: NC/49.9K 1%; Part Type: 贴片电阻
R35 = R: SMD  0402  49.9K  1/16W  ±1%  ROHS; Part Reference: R35; Part Number: A1R01.00309; PCB Footprint: R0402; Value: NC/49.9K 1%; Part Type: 贴片电阻
R36 = R: SMD  0402  100K  1/16W  ±1%  ROHS; Part Reference: R36; Part Number: A1R01.00031; CDS_PART_NAME: R_0402-100K,1 %,62.5MW,195-0005-000; CDS_PHYS_PART_NAME: R_0402-100K,1 %,62.5MW,195-0005-000-100K,195-0005-000; Temp Coeff: －55℃ ~ ＋155℃; ASSEMBLY: DCJACK; CDS_LIB: discrete; CDS_SEC: 1; DEVICE_TYPENAME: R_0402-100K1625MW195-0005-000-100K195-0005-000; DRAWING: #NAME?; LOCATION: R181; MAX_WATTAGE: 62.5mW; NV_PN: 195-0005-000; PACK_TYPE: 402; PATH: I57; PHYS_PAGE: 7; ROT: 0; VER: 2; XY: (-5600,4450); PCB Footprint: R0402; Value: 100K 1%; Part Type: 贴片电阻; CHIPS_PART_NAME: R; TOL: 1%; SEC: 1
R37 = R: SMD  0402  100K  1/16W  ±1%  ROHS; Part Reference: R37; Part Number: A1R01.00031; CDS_PART_NAME: R_0402-100K,1 %,62.5MW,195-0005-000; CDS_PHYS_PART_NAME: R_0402-100K,1 %,62.5MW,195-0005-000-100K,195-0005-000; Temp Coeff: －55℃ ~ ＋155℃; ASSEMBLY: DCJACK; CDS_LIB: discrete; CDS_SEC: 1; DEVICE_TYPENAME: R_0402-100K1625MW195-0005-000-100K195-0005-000; DRAWING: #NAME?; LOCATION: R182; MAX_WATTAGE: 62.5mW; NV_PN: 195-0005-000; PACK_TYPE: 402; PATH: I58; PHYS_PAGE: 7; ROT: 0; VER: 2; XY: (-5600,3950); PCB Footprint: R0402; Value: 100K 1%; Part Type: 贴片电阻; CHIPS_PART_NAME: R; TOL: 1%; SEC: 1
R38 = R: SMD  0201  51K  1/20W  ±5%  ROHS; Part Reference: R38; Part Number: A1R01.00093; PCB Footprint: R0201; Preferred: 6715f349cd0bc5; Value: 51K 5%; Part Type: 贴片电阻
R39 = R: SMD  0201  1M  1/20W  ±1%  ROHS; Part Reference: R39; Part Number: A1R01.00435; PCB Footprint: R0201; Value: 1M 1%; Part Type: 贴片电阻
R40 = R: SMD  0201  10K  1/20W  ±5%  ROHS; Part Reference: R40; Part Number: A1R01.00012; PCB Footprint: R0201; Temp Coeff: －55℃ ~ ＋125℃; Value: 10K 5%; Part Type: 贴片电阻
R41 = R: SMD  0201  10K  1/20W  ±5%  ROHS; Part Reference: R41; Part Number: A1R01.00012; PCB Footprint: R0201; Temp Coeff: －55℃ ~ ＋125℃; Value: 10K 5%; Part Type: 贴片电阻
R42 = R: SMD  0201  1M  1/20W  ±1%  ROHS; Part Reference: R42; Part Number: A1R01.00435; PCB Footprint: R0201; Value: 1M 1%; Part Type: 贴片电阻
R43 = R: SMD  0201  0R  1/20W  ±5%  ROHS; Part Reference: R43; Part Number: A1R01.00027; PCB Footprint: R0201; Temp Coeff: －55℃ ~ ＋125℃; Value: 0R 5%; Part Type: 贴片电阻
R44 = R: SMD  0201  10K  1/20W  ±5%  ROHS; Part Reference: R44; Part Number: A1R01.00012; PCB Footprint: R0201; Temp Coeff: －55℃ ~ ＋125℃; Value: 10K 5%; Part Type: 贴片电阻
R46 = R: SMD  0402  10K  1/16W  ±1%  ROHS; Part Reference: R46; Part Number: A1R01.00222; PCB Footprint: R0402; Value: NC/10K 1%; Part Type: 贴片电阻
R47 = R: SMD  0402  1K  1/16W  ±1%  ROHS; Part Reference: R47; Part Number: A1R01.00040; PCB Footprint: R0402; Value: 1K 1%; Part Type: 贴片电阻
R48 = R: SMD  0402  100K  1/16W  ±1%  ROHS; Part Reference: R48; Part Number: A1R01.00031; Temp Coeff: －55℃ ~ ＋155℃; PCB Footprint: R0402; Value: 100K 1%; Part Type: 贴片电阻
R49 = R: SMD  0402  10K  1/16W  ±1%  ROHS; Part Reference: R49; Part Number: A1R01.00222; PCB Footprint: R0402; Value: NC/10K 1%; Part Type: 贴片电阻
R50 = R: SMD  0402  10K  1/16W  ±1%  ROHS; Part Reference: R50; Part Number: A1R01.00222; PCB Footprint: R0402; Value: 10K 1%; Part Type: 贴片电阻
R51 = R: SMD  0402  10K  1/16W  ±1%  ROHS; Part Reference: R51; Part Number: A1R01.00222; PCB Footprint: R0402; Value: 10K 1%; Part Type: 贴片电阻
R52 = R: SMD  0402  10K  1/16W  ±1%  ROHS; Part Reference: R52; Part Number: A1R01.00222; PCB Footprint: R0402; Value: NC/10K 1%; Part Type: 贴片电阻
R53 = R: SMD  0402  22K  1/16W  ±1%  ROHS; Part Reference: R53; Part Number: A1R01.00083; PCB Footprint: R0402; Value: 22K 1%; Part Type: 贴片电阻
R54 = R: SMD  0402  10K  1/16W  ±1%  ROHS; Part Reference: R54; CDS_PART_NAME: R_0402-10K,1 %,62.5MW,195-0004-000; CDS_PHYS_PART_NAME: R_0402-10K,1 %,62.5MW,195-0004-000-10K,195-0004-000; Part Number: A1R01.00222; ASSEMBLY: PS_3V3; CDS_LIB: discrete; CDS_SEC: 1; DEVICE_TYPENAME: R_0402-10K1625MW195-0004-000-10K195-0004-000; DRAWING: #NAME?; LOCATION: R164; MAX_WATTAGE: 62.5mW; NV_PN: 195-0004-000; PACK_TYPE: 402; PATH: I38; PHYS_PAGE: 9; ROT: 0; SIGNAL_MODEL: nv_res; VER: 2; XY: (-3400,3450); PCB Footprint: R0402; Value: 10K 1%; CHIPS_PART_NAME: R; TOL: 1%; SEC: 1; Part Type: 贴片电阻
R73 = R: SMD  1206  1R  1/4W  ±1%  ROHS; Part Reference: R73; Part Number: A1R01.00198; PCB Footprint: R1206; Value: 1R 1%; Part Type: 贴片电阻
R74 = R: SMD  0201  100K  1/20W  ±1%  ROHS; Part Reference: R74; Part Number: A1R01.00165; PCB Footprint: R0201; Value: 100K 1%; Part Type: 贴片电阻
R78 = R: SMD  0201  510K  1/20W  ±5%  ROHS; Part Reference: R78; Part Number: A1R01.00089; PCB Footprint: R0201; Value: 510K 5%; Part Type: 贴片电阻
R81 = R: SMD  0402  10K  1/16W  ±1%  ROHS; Part Reference: R81; Part Number: A1R01.00222; CDS_PHYS_PART_NAME: R_0402-10K,1 %,62.5MW,195-0004-000-10K,195-0004-000; CDS_PART_NAME: R_0402-10K,1 %,62.5MW,195-0004-000; SEC: 1; XY: (-1700,2950); VER: 2; SIGNAL_MODEL: nv_res; ROT: 0; PHYS_PAGE: 8; PATH: I47; PACK_TYPE: 402; NV_PN: 195-0004-000; MAX_WATTAGE: 62.5mW; LOCATION: R163; DRAWING: #NAME?; DEVICE_TYPENAME: R_0402-10K1625MW195-0004-000-10K195-0004-000; CDS_LIB: discrete; ASSEMBLY: PS_5V; PCB Footprint: R0402; Value: 10K 1%; Part Type: 贴片电阻; TOL: 1%; CHIPS_PART_NAME: R; CDS_SEC: 1
R82 = R: SMD  0201  1K  1/20W  ±5%  ROHS; Part Reference: R82; Part Number: A1R01.00018; PCB Footprint: R0201; Value: 1K 5%; Part Type: 贴片电阻
R83 = R: SMD  0201  510K  1/20W  ±5%  ROHS; Part Reference: R83; Part Number: A1R01.00089; PCB Footprint: R0201; Value: 510K 5%; Part Type: 贴片电阻
R91 = R: SMD  1206  1R  1/4W  ±1%  ROHS; Part Reference: R91; Part Number: A1R01.00198; PCB Footprint: R1206; Value: 1R 1%; Part Type: 贴片电阻
R118 = R: SMD  0402  10K  1/16W  ±1%  ROHS; Part Reference: R118; Part Number: A1R01.00222; PCB Footprint: R0402; Value: NC/10K 1%; Part Type: 贴片电阻
R123 = R: SMD  0402  1K  1/16W  ±1%  ROHS; Part Reference: R123; Part Number: A1R01.00040; PCB Footprint: R0402; Value: 1K 1%; Part Type: 贴片电阻
R125 = R: SMD  0402  100K  1/16W  ±1%  ROHS; Part Reference: R125; Part Number: A1R01.00031; Temp Coeff: －55℃ ~ ＋155℃; PCB Footprint: R0402; Value: 100K 1%; Part Type: 贴片电阻
R129 = R: SMD  0402  10K  1/16W  ±1%  ROHS; Part Reference: R129; Part Number: A1R01.00222; PCB Footprint: R0402; Value: NC/10K 1%; Part Type: 贴片电阻
R130 = R: SMD  0402  10K  1/16W  ±1%  ROHS; Part Reference: R130; Part Number: A1R01.00222; PCB Footprint: R0402; Value: 10K 1%; Part Type: 贴片电阻
R142 = R: SMD  0402  10K  1/16W  ±1%  ROHS; Part Reference: R142; Part Number: A1R01.00222; PCB Footprint: R0402; Value: 10K 1%; Part Type: 贴片电阻
R143 = R: SMD  0402  10K  1/16W  ±1%  ROHS; Part Reference: R143; Part Number: A1R01.00222; PCB Footprint: R0402; Value: NC/10K 1%; Part Type: 贴片电阻
R153 = R: SMD  0402  22K  1/16W  ±1%  ROHS; Part Reference: R153; Part Number: A1R01.00083; PCB Footprint: R0402; Value: 22K 1%; Part Type: 贴片电阻
U3 = SY8386J: SMD  DCDC  SY8386J  在 4.5V - 24V 宽输入电压范围内提供 6A 电流  QFN16  Silergy(矽力杰)  ROHS; Part Reference: U3; Part Number: A1I01.00686; parameter: DCDC-Silergy 6A DCDC-封装  QFN2.5x2.5-16; PCB Footprint: QFN16_0D45_2D5; Value: SY8386J; Part Type: 集成电路/模块
U4 = SY8370c1: Part Reference: U4; PCB Footprint: QFN13_0D45_3; Value: SY8370c1
U6 = SY8386J: SMD  DCDC  SY8386J  在 4.5V - 24V 宽输入电压范围内提供 6A 电流  QFN16  Silergy(矽力杰)  ROHS; Part Reference: U6; Part Number: A1I01.00686; parameter: DCDC-Silergy 6A DCDC-封装  QFN2.5x2.5-16; PCB Footprint: QFN16_0D45_2D5; Value: SY8386J; Part Type: 集成电路/模块
* = radxa_1010: Page Create Date: March  8, 1995; Page Size: =PageSize; Page Modify Date: =ModifiedDate